# Altium schematic sheet powersupply.SchDoc: Linda 50 - Power Suply
size A4; Author: Eduardo Marques; Organization: Linda Hand Build Amplifiers
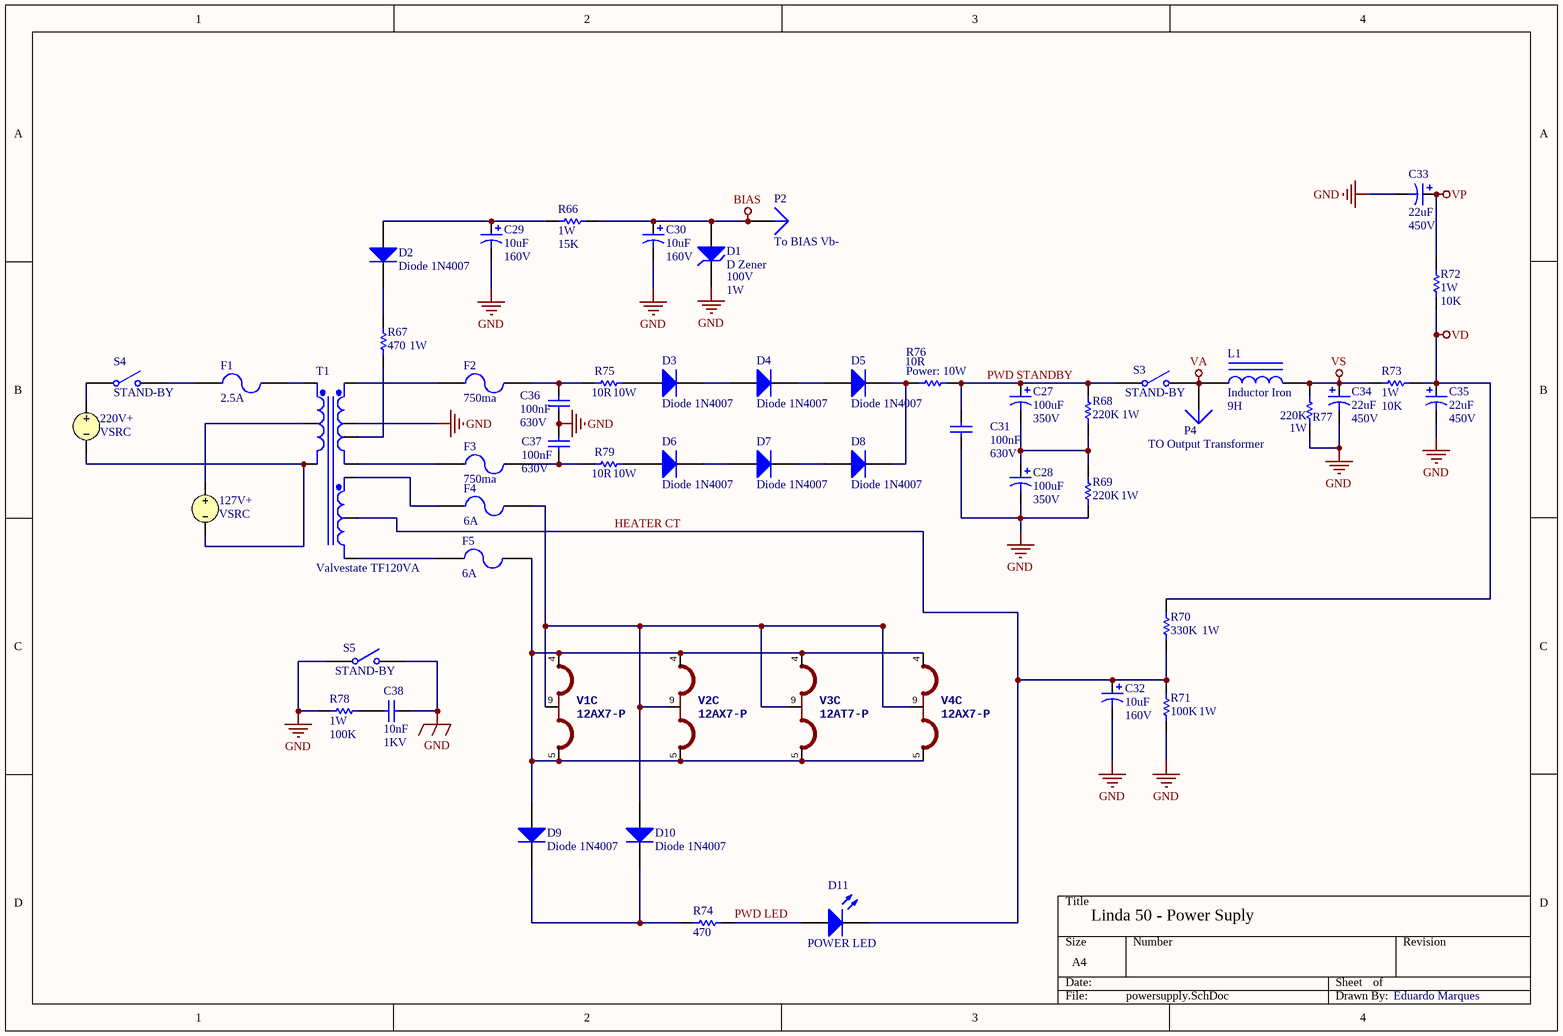
[diagram p0: powersupply.SchDoc]

## Parts
127V+  VSRC
220V+  VSRC
C27  value 100uF  Voltage: 350V  [FT Eletrolitic 100uF Axial]  (hidden comment: Cap FT Eletrolitic 100uF Axial 350V)
C28  value 100uF  Voltage: 350V  [FT Eletrolitic 100uF Axial]  (hidden comment: Cap FT Eletrolitic 100uF Axial 350V)
C29  value 10uF  Voltage: 160V  [RAD-POL-16x20x7.5]  (hidden comment: Cap Pol Radial Vishay 22uF 100V)
C30  value 10uF  Voltage: 160V  [RAD-POL-16x20x7.5]  (hidden comment: Cap Pol Radial Vishay 22uF 100V)
C31  value 100nF  Voltage: 630V  [CAP-XICON-100nF-630V]  (hidden comment: Orange Drop Capacitor)
C32  value 10uF  Voltage: 160V  [RAD-POL-16x20x7.5]  (hidden comment: Cap Pol Radial Vishay 22uF 100V)
C33  value 22uF  Voltage: 450V  [RAD-POL-7.6-15]  (hidden comment: Cap Pol Rad)
C34  value 22uF  Voltage: 450V  [RAD-POL-7.6-15]  (hidden comment: Cap Pol Rad)
C35  value 22uF  Voltage: 450V  [RAD-POL-7.6-15]  (hidden comment: Cap Pol Rad)
C36  value 100nF  Voltage: 630V  [CAP-XICON-100nF-630V]  (hidden comment: Orange Drop Capacitor)
C37  value 100nF  Voltage: 630V  [CAP-XICON-100nF-630V]  (hidden comment: Orange Drop Capacitor)
C38  value 10nF  Voltage: 1KV  [RAD-0.4]  (hidden comment: Orange Drop Capacitor)
D1  D Zener  Voltage: 100V  Power: 1W  [ZENER 1W 100V]
D2  Diode 1N4007  [DO-41]
D3  Diode 1N4007  [1N4007-10.46mm Diode]
D4  Diode 1N4007  [1N4007-10.46mm Diode]
D5  Diode 1N4007  [1N4007-10.46mm Diode]
D6  Diode 1N4007  [1N4007-10.46mm Diode]
D7  Diode 1N4007  [1N4007-10.46mm Diode]
D8  Diode 1N4007  [1N4007-10.46mm Diode]
D9  Diode 1N4007  [1N4007-10.46mm Diode]
D10  Diode 1N4007  [1N4007-10.46mm Diode]
D11  POWER LED  [LED-1]
F1  2.5A  [PIN-W2/E2.8]
F2  750ma  [FUSE-PCB-6x31]
F3  750ma  [FUSE-PCB-6x31]
F4  6A  [FUSE-PCB-6x31]
F5  6A  [FUSE-PCB-6x31]
L1  Inductor Iron  value 9H  [AXIAL-0.9]
P2  To BIAS Vb-  [PIN1]
P4  TO Output Transformer  [PIN1]
R66  value 15K  Power: 1W  [AXIAL-0.6]  (hidden comment: Metal Film Resistor 1W)
R67  value 470  Power: 1W  [AXIAL-0.6]  (hidden comment: Metal Film Resistor 1W)
R68  value 220K  Power: 1W  [RESISTOR-MetalOxide-3W]  (hidden comment: Metal Film Resistor 1W)
R69  value 220K  Power: 1W  [RESISTOR-MetalOxide-3W]  (hidden comment: Metal Film Resistor 1W)
R70  value 330K  Power: 1W  [AXIAL-0.6]  (hidden comment: Metal Film Resistor 1W)
R71  value 100K  Power: 1W  [AXIAL-0.6]  (hidden comment: Metal Film Resistor 1W)
R72  value 10K  Power: 1W  [AXIAL-0.6]  (hidden comment: Metal Film Resistor 1W)
R73  value 10K  Power: 1W  [AXIAL-0.6]  (hidden comment: Metal Film Resistor 1W)
R74  value 470  [AXIAL-0.6]  (hidden comment: Metal Film Resistor 1/2W)
R75  value 10R  Power: 10W  [AXIAL-1.0]  (hidden comment: Wire Wound Power Resistor)
R76  value 10R  Power: 10W  [Power Wirewound Resistor 10W - Vishay Dale]  (hidden comment: Wire Wound Power Resistor)
R77  value 220K  Power: 1W  [RESISTOR-MetalOxide-3W]  (hidden comment: Metal Film Resistor 1W)
R78  value 100K  Power: 1W  [AXIAL-0.6]  (hidden comment: Metal Film Resistor 1W)
R79  value 10R  Power: 10W  [AXIAL-1.0]  (hidden comment: Wire Wound Power Resistor)
S3  STAND-BY  [SPST-2]
S4  STAND-BY  [SPST-2]
S5  STAND-BY  [SPST-2]
T1  Valvestate TF120VA  [TRF_5]
V1  12AX7-P  [NOVAL]  (part C of 3)
V2  12AX7-P  [NOVAL]  (part C of 3)
V3  12AT7-P  [NOVAL]  (part C of 3)
V4  12AX7-P  [NOVAL]  (part C of 3)

## Nets
BIAS: C30.1 D1.1(A) P2.1 R66.1
GND: C28.2 C29.2 C30.2 C31.1 C32.2 C33.2 C34.2 C35.2 C36.1 C37.2 C38.1 D1.2(K) R69.1 R71.1 R77.1 R78.2 S5.1(COMMON) S5.2(NO) T1.5(SEC_CT)
VA: L1.1 P4.1 S3.2(NO)
VD: C35.1 R70.2 R72.2 R73.1
VP: C33.1 R72.1
VS: C34.1 L1.2 R73.2 R77.2
HEATER CT: C32.1 D11.2(K) R70.1 R71.2 T1.9(3.15V_CT)
PWD STANDBY: C27.1 C31.2 R68.2 R76.2 S3.1(COMMON)
Net127V+_1: 127V+.1 T1.2(Pri+_127V)
Net127V+_2: 127V+.2 220V+.2 T1.3(Pri-)
Net220V+_1: 220V+.1 S4.1(COMMON)
NetC27_2: C27.2 C28.1 R68.1 R69.2
NetC29_1: C29.1 D2.1(A) R66.2
NetC36_2: C36.2 F2.2 R75.1
NetC37_1: C37.1 F3.2 R79.1
NetC38_2: C38.2 R78.1
NetD2_2: D2.2(K) R67.2
NetD3_1: D3.1(A) R75.2
NetD3_2: D3.2(K) D4.1(A)
NetD4_2: D4.2(K) D5.1(A)
NetD5_2: D5.2(K) D8.2(K) R76.1
NetD6_1: D6.1(A) R79.2
NetD6_2: D6.2(K) D7.1(A)
NetD7_2: D7.2(K) D8.1(A)
NetD9_1: D9.1(A) F5.2 V1.4(H1) V1.5(H3) V2.4(H1) V2.5(H3) V3.4(H1) V3.5(H3) V4.4(H1) V4.5(H3)
NetD9_2: D9.2(K) D10.2(K) R74.1
NetD10_1: D10.1(A) F4.2 V1.9(H2) V2.9(H2) V3.9(H2) V4.9(H2)
NetD11_1: D11.1(A) R74.2
NetF1_1: F1.1 S4.2(NO)
NetF1_2: F1.2 T1.1(Pri+220V)
NetF2_1: F2.1 T1.4(Sec_355V_+)
NetF3_1: F3.1 T1.7(Sec_355V_-)
NetF4_1: F4.1 T1.8(3.15V+)
NetF5_1: F5.1 T1.10(3.15V_-)
NetR67_1: R67.1 T1.6(Sec_55V_+)

## Notes on the sheet
- Labels drawn without touching a wire or pin: PWD LED

## Library data of the parts
127V+ 220V+ = VSRC: Voltage Source; Note: PCB Footprint - Not required; Value: +220; Published: 8-Jun-2000; LatestRevisionDate: 17-Jul-2002; LatestRevisionNote: Re-released for DXP Platform.; PackageReference: Not Applicable; Publisher: Altium Limited
C27 C28 = Cap FT Eletrolitic 100uF Axial 350V: FT Eletrolitic Polarized Capacitor Axial 100uF; Published: 8-Jun-2000; LatestRevisionDate: 12-Feb-2014; LatestRevisionNote: Re-released for DXP Platform.; PackageReference: POLAR0.8; Publisher: Whitesheep Amps; PackageDescription: Polarized Capacitor; 2 Leads
C29 C30 C32 = Cap Pol Radial Vishay 22uF 100V: Vishay 22uF 100V Polarized Capacitor (Radial); 2 Leads; Part Number: 142 RHS; Published: 8-Jun-2000; LatestRevisionDate: 17-Jul-2002; LatestRevisionNote: Re-released for DXP Platform.; PackageReference: POLAR0.8; Publisher: Altium Limited; PackageDescription: Polarized Capacitor; 2 Leads
C31 C36-C38 = Cap-XICON-100nF-630V: Capacitor XICON (WINE COVER) Polypropilene CAP 630V; Published: 8-Jun-2000; LatestRevisionDate: 17-Jul-2002; LatestRevisionNote: Re-released for DXP Platform.; PackageReference: RAD-0.3; Publisher: Altium Limited; PackageDescription: Radial Cap, Thru-Hole; 2 Leads; 0.3 in Pin Spacing
C33-C35 = Cap Pol Rad: Polarized Capacitor (Axial); Published: 8-Jun-2000; LatestRevisionDate: 17-Jul-2002; LatestRevisionNote: Re-released for DXP Platform.; PackageReference: POLAR0.8; Publisher: Altium Limited; PackageDescription: Polarized Capacitor; 2 Leads
D1 = D Zener: Zener Diode; Model: 1N4764A; Builder: Vishay; Published: 8-Jun-2000; LatestRevisionDate: 17-Jul-2002; LatestRevisionNote: Re-released for DXP Platform.; PackageReference: DIODE-0.7; Publisher: Altium Limited; PackageDescription: Diode, Thru-Hole; 2 Leads; 0.7 in Pin Spacing
D2-D10 = Diode 1N4007: 1 Amp General Purpose Rectifier; Published: 8-Jun-2000; LatestRevisionDate: 17-Jul-2002; LatestRevisionNote: Re-released for DXP Platform.; DatasheetVersion: 1998; PackageVersion: Aug-1999; PackageReference: DO-41; Publisher: Altium Limited; PackageDescription: Diode, Axial; Body 5.2 x 2.7 mm (LxDia. max), Lead Dia. 0.86 mm (max); Code_JEDEC: DO-204-AL; ComponentLink1Description: Manufacturer Link; ComponentLink1URL: http://www.fairchildsemi.com/; ComponentLink2Description: Datasheet; ComponentLink2URL: http://www.fairchildsemi.com/ds/1N%2F1N4001.pdf
D11 = LED1: Typical RED GaAs LED; Published: 8-Jun-2000; LatestRevisionDate: 08-Jul-2005; LatestRevisionNote: Mech Layer 1 removed.; PackageReference: LED-1; Publisher: Altium Limited; PackageDescription: LED; 2 Leads
F1-F5 = Fuse 2: Fuse; Published: 8-Jun-2000; LatestRevisionDate: 17-Jul-2002; LatestRevisionNote: Re-released for DXP Platform.; PackageReference: PIN-W2/E2.8; Publisher: Altium Limited; PackageDescription: Thru-Hole; 2 Leads
L1 = Inductor Iron: Magnetic-Core Inductor; Published: 24-Mar-1999; LatestRevisionDate: 17-Jul-2002; LatestRevisionNote: Re-released for DXP Platform.; PackageReference: AXIAL-0.9; Publisher: Altium Limited; PackageDescription: Axial Device, Thru-Hole; 2 Leads; 0.9 in Pin Spacing
P2 P4 = Plug: LatestRevisionDate: 17-Jul-2002; LatestRevisionNote: Re-released for DXP Platform.; Publisher: Altium Limited
R66-R73 R77 R78 = Res Wire Wound 1W: Semiconductor Resistor; Published: 8-Jun-2000; LatestRevisionDate: 29-Mar-2014; LatestRevisionNote: 19-Mar-2014; PackageReference: AXIAL-0.5; Publisher: Linda Hand Buit Amplifiers; PackageDescription: Axial Device, Thru-Hole; 2 Leads; 0.5 in Pin Spacing
R74 = Res Metal Film 1/2W: Semiconductor Resistor; Published: 8-Jun-2000; LatestRevisionDate: 17-Jul-2002; LatestRevisionNote: 12-Fev-2014; PackageReference: AXIAL-0.5; Publisher: Whitesheep Amps; PackageDescription: Axial Device, Thru-Hole; 2 Leads; 0.5 in Pin Spacing; Power: 1/2W
R75 R79 = Res Wire Wound Power Resistor 5W: Semiconductor Resistor; Published: 8-Jun-2014; LatestRevisionDate: 17-Jul-2002; LatestRevisionNote: 12-Fev-2014; PackageReference: AXIAL-1.0; Publisher: Whitesheep Amps; PackageDescription: Axial Device, Thru-Hole; 2 Leads; 0.5 in Pin Spacing
R76 = Res Vishay Dale Wire Wound Power Resistor 10R 10W: Semiconductor Resistor; Manufacturer Part Number: RS01010R00FE73; Published: 8-Jun-2014; LatestRevisionDate: 17-Jul-2002; LatestRevisionNote: 12-Fev-2014; PackageReference: AXIAL-1.0; Publisher: Whitesheep Amps; PackageDescription: Axial Device, Thru-Hole; 2 Leads; 0.5 in Pin Spacing
S3-S5 = SW-SPST: Single-Pole, Single-Throw Switch; Published: 24-Mar-1999; LatestRevisionDate: 17-Jul-2002; LatestRevisionNote: Re-released for DXP Platform.; PackageReference: SPST-2; Publisher: Altium Limited; PackageDescription: Switch; 2 Leads
T1 = Valvestate TF120VA: VALVESTATE TF 120VA; Published: 29-Mar-2014; LatestRevisionDate: 29-Mar-2014; LatestRevisionNote: Construção do Trafo Hammond para Bassman 5F6A; PackageReference: TRF_10; Publisher: LINDA Hand Built Amplifiers; PackageDescription: Transformer; 10Leads